# Altium project Pulser_10-2023.PrjPcb
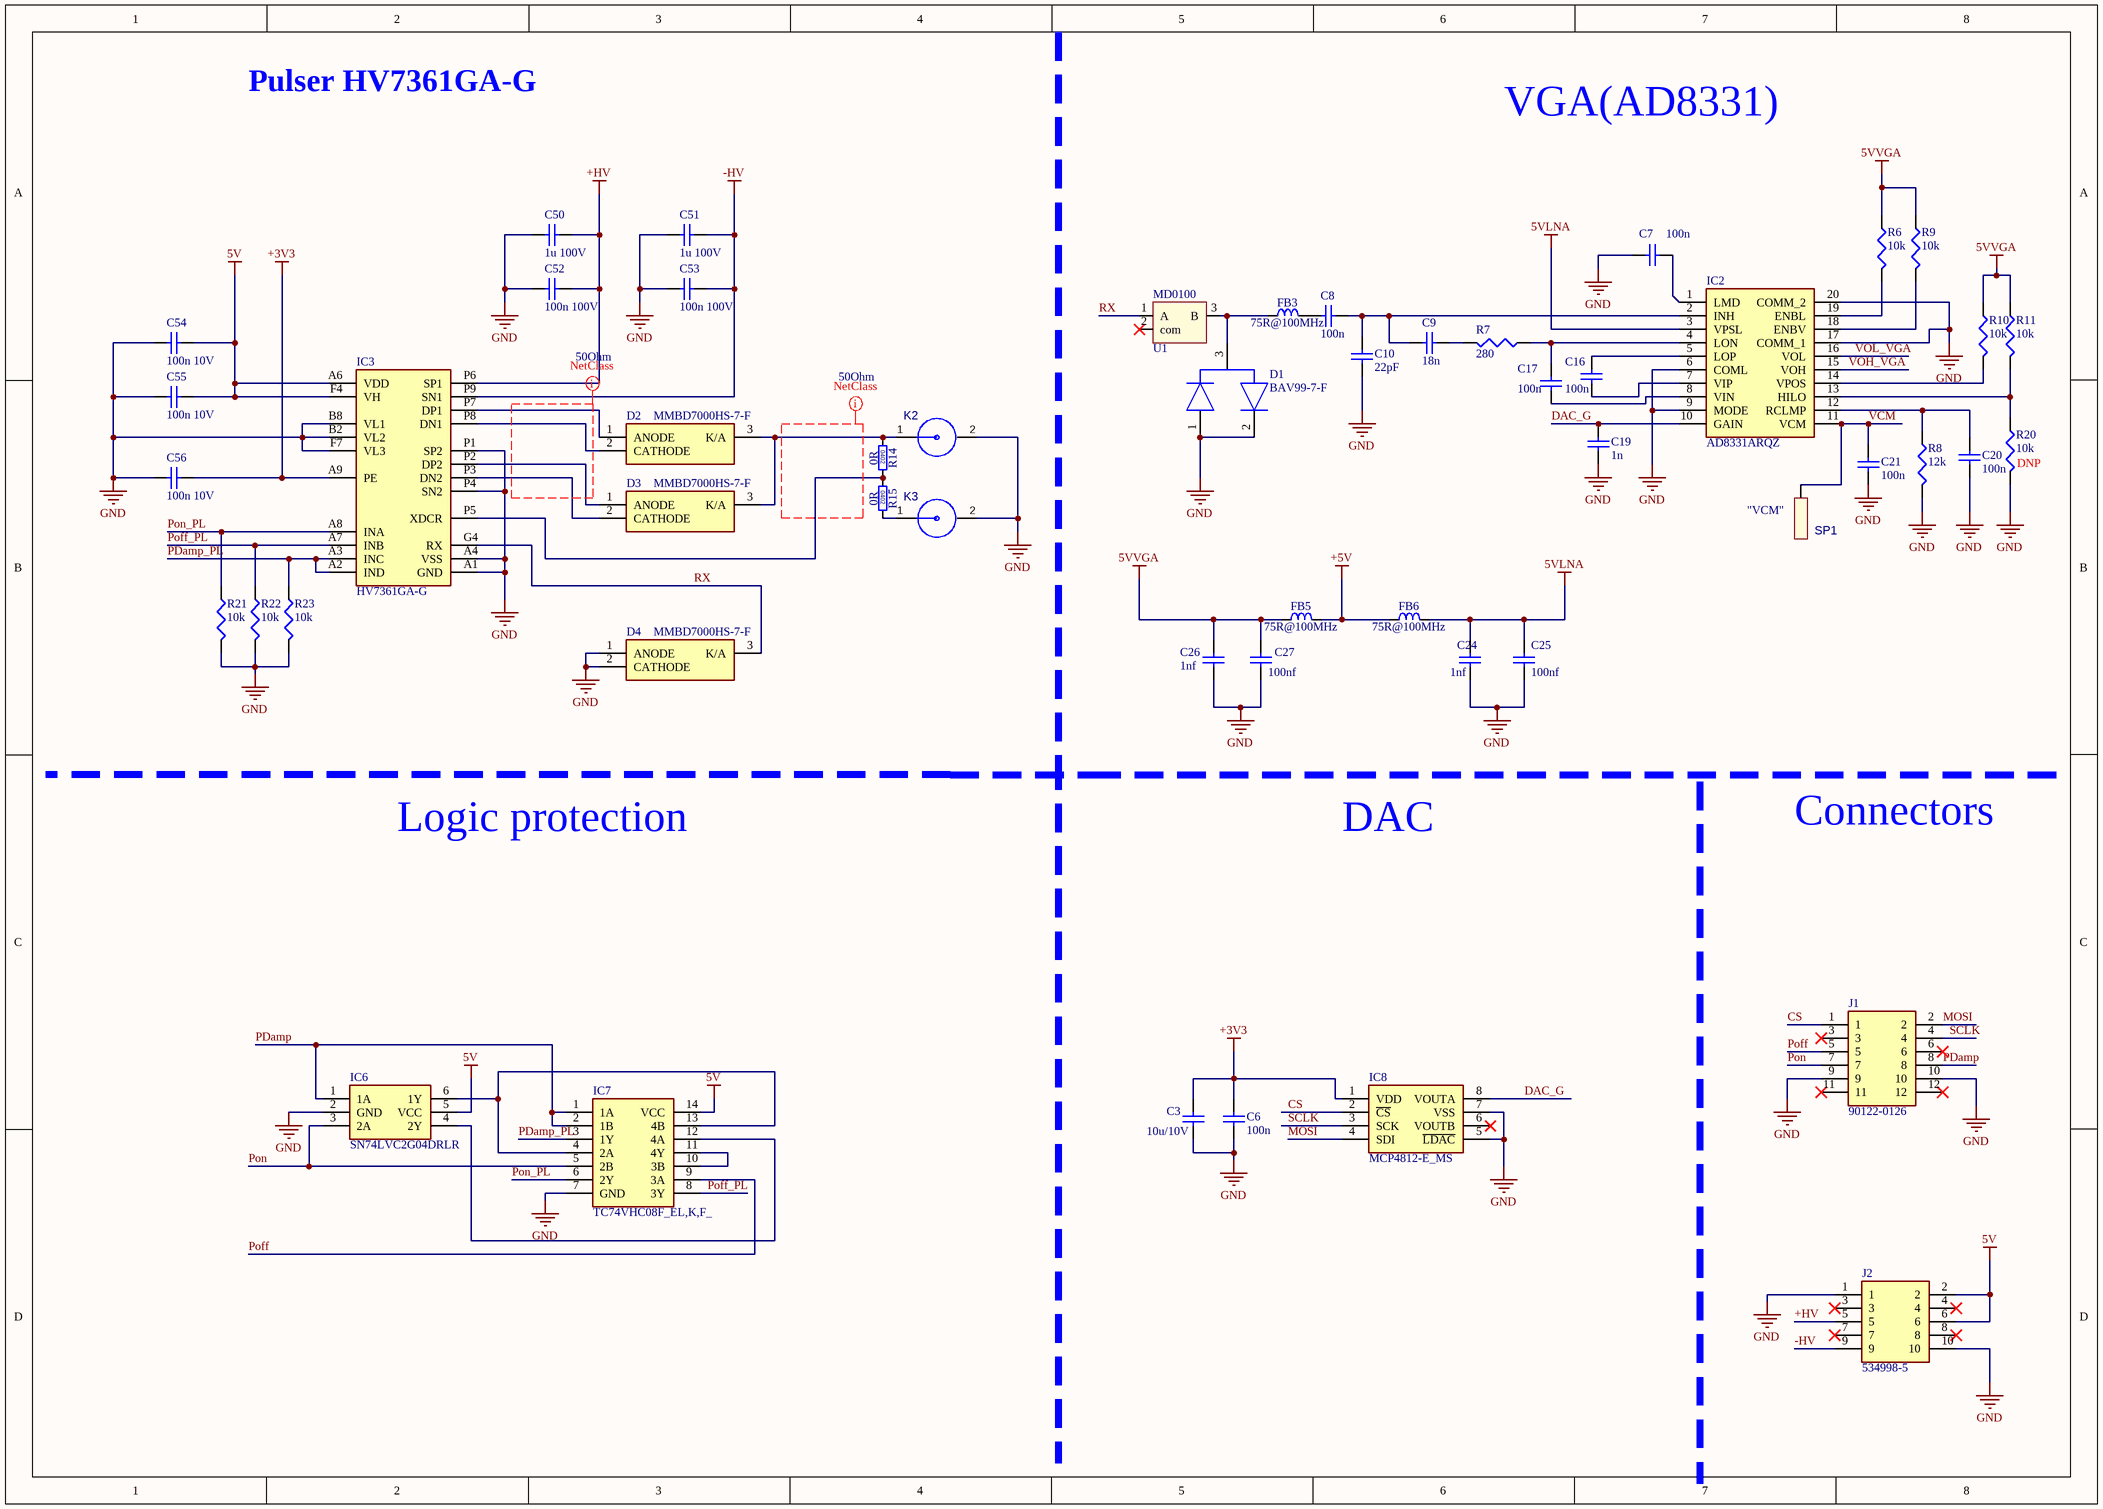
[diagram p0: Pulser & AD8331.SchDoc]
2 sheets, 123 parts. Net scope: global (net labels, ports and power ports of the same name join across sheets).
Board file: Pulser_10-2023.PcbDoc
Sheets:
  Pulser & AD8331.SchDoc
  MSI001 & MSI2500 .SchDoc

## Sheet Pulser & AD8331.SchDoc
size A3

### Parts
C3  value 10u/10V  [0402_C]  (hidden comment: cap0603)
C6  value 100n  [0402_C]  (hidden comment: cap0402)
C7  value 100n  [0402_C]  (hidden comment: cap0402)
C8  value 100n  [0402_C]  (hidden comment: cap0402)
C9  value 18n  [0402_C]  (hidden comment: cap0402)
C10  value 22pF  [0402_C]  (hidden comment: cap0402)
C16  value 100n  [0402_C]  (hidden comment: cap0402)
C17  value 100n  [0402_C]  (hidden comment: cap0402)
C19  value 1n  [0402_C]  (hidden comment: cap0402)
C20  value 100n  [0402_C]  (hidden comment: cap0402)
C21  value 100n  [0402_C]  (hidden comment: cap0402)
C24  value 1nf  [0402_C]  (hidden comment: cap0402)
C25  value 100nf  [0402_C]  (hidden comment: cap0402)
C26  value 1nf  [0402_C]  (hidden comment: cap0402)
C27  value 100nf  [0402_C]  (hidden comment: cap0402)
C50  value 1u 100V  [C0805]  (hidden comment: cap0603)
C51  value 1u 100V  [C0805]  (hidden comment: cap0603)
C52  value 100n 100V  [0402_C]  (hidden comment: cap0402)
C53  value 100n 100V  [0402_C]  (hidden comment: cap0402)
C54  value 100n 10V  [0402_C]  (hidden comment: cap0402)
C55  value 100n 10V  [0402_C]  (hidden comment: cap0402)
C56  value 100n 10V  [0402_C]  (hidden comment: cap0402)
D1  BAV99-7-F  [SOT95P240X120-3N]
D2  MMBD7000HS-7-F  [SOT96P240X110-3N_]
D3  MMBD7000HS-7-F  [SOT96P240X110-3N_]
D4  MMBD7000HS-7-F  [SOT96P240X110-3N_]
FB3  75R@100MHz  [SM0603_3D_res]
FB5  75R@100MHz  [SM0603_3D_res]
FB6  75R@100MHz  [SM0603_3D_res]
IC2  AD8331ARQZ  [SOP64P600X175-20N]
IC3  HV7361GA-G  [BGA22C50P9X14_500X700X105]
IC6  SN74LVC2G04DRLR  [SOTFL50P160X60-6N]
IC7  TC74VHC08F_EL,K,F_  [SOIC127P780X190-14N_]
IC8  MCP4812-E_MS  [SOP65P490X110-8N]
J1  90122-0126  [HDRRA12W65P254_2X6_1516X250X615P]
J2  534998-5  [RHDR10W77P254X254_2X5_1270X503X635P]
K2  SMA_Edge  [AMPHENOL_132357-11]  (value not drawn)
K3  SMA_Edge  [AMPHENOL_132357-11]  (value not drawn)
R6  10k  [0402_R]
R7  280  [0402_R]
R8  12k  [0402_R]
R9  10k  [0402_R]
R10  10k  [0402_R]
R11  10k  [0402_R]
R14  0R  [0402_R]
R15  0R  [0402_R]
R20  10k  [0402_R]
R21  10k  [0402_R]
R22  10k  [0402_R]
R23  10k  [0402_R]
SP1  value "VCM"  [SolderPad_D1mm _round]  (hidden comment: SolderPad D1mm_round)
U1  T/R switch  [SOT89-150P409X160-3N]  (value not drawn)

### Nets
5V: C54.1 C55.1 IC3.A6(VDD) IC3.F4(VH) IC6.5(VCC) IC7.14(VCC) J2.2 J2.6
5VLNA: C24.2 C25.2 FB6.2 IC2.3(VPSL)
5VVGA: C26.2 C27.2 FB5.1 R6.1 R9.1 R10.1 R11.1
+3V3: C3.1 C6.1 C56.1 IC3.A9(PE) IC8.1(VDD)
+5V: FB5.2 FB6.1
+HV: C50.1 C52.2 IC3.P6(SP1) J2.5
-HV: C51.1 C53.2 IC3.P9(SN1) J2.9
GND: C3.2 C6.2 C7.1 C10.1 C19.1 C20.1 C21.2 C24.1 C25.1 C26.1 C27.1 C50.2 C51.2 C52.1 C53.1 C54.2 C55.2 C56.2 D1.1(ANODE) D1.2(CATHODE) D4.1(ANODE) D4.2(CATHODE) IC2.6(COML) IC2.9(MODE) IC2.17(COMM_1) IC2.20(COMM_2) IC3.A1(GND) IC3.A4(VSS) IC3.B2(VL2) IC3.B8(VL1) IC3.F7(VL3) IC3.P1(SP2) IC3.P4(SN2) IC6.2(GND) IC7.7(GND) IC8.5(~{LDAC}) IC8.7(VSS) J1.9 J1.10 J2.1 J2.10 K2.2 K3.2 R8.2 R20.2 R21.2 R22.2 R23.2
CS: IC8.2(~{CS}) J1.1
DAC_G: C19.2 IC2.10(GAIN) IC8.8(VOUTA)
MOSI: IC8.4(SDI) J1.2
PDamp: IC6.1(1A) IC7.1(1A) IC7.2(1B) J1.8
PDamp_PL: IC3.A2(IND) IC3.A3(INC) IC7.3(1Y) R23.1
Poff: IC7.9(3A) J1.5
Poff_PL: IC3.A7(INB) IC7.8(3Y) R22.1
Pon: IC6.3(2A) IC7.5(2B) J1.7
Pon_PL: IC3.A8(INA) IC7.6(2Y) R21.1
RX: D4.3(K/A) IC3.G4(RX) U1.1(A)
SCLK: IC8.3(SCK) J1.4
VCM: C21.1 IC2.11(VCM) SP1.1
VOH_VGA: IC2.15(VOH)
VOL_VGA: IC2.16(VOL)
NetC7_2: C7.2 IC2.1(LMD)
NetC8_1: C8.1 FB3.2
NetC8_2: C8.2 C9.2 C10.2 IC2.2(INH)
NetC9_1: C9.1 R7.2
NetC16_1: C16.1 IC2.7(VIP)
NetC16_2: C16.2 IC2.5(LOP)
NetC17_1: C17.1 IC2.8(VIN)
NetC17_2: C17.2 IC2.4(LON) R7.1
NetC20_2: C20.2 IC2.12(RCLMP) R8.1
NetD1_3: D1.3(A/K) FB3.1 U1.3(B)
NetD2_1: D2.1(ANODE) IC3.P7(DP1)
NetD2_2: D2.2(CATHODE) IC3.P8(DN1)
NetD2_3: D2.3(K/A) D3.3(K/A) K2.1 R14.1
NetD3_1: D3.1(ANODE) IC3.P2(DP2)
NetD3_2: D3.2(CATHODE) IC3.P3(DN2)
NetIC2_13: IC2.13(HILO) R11.2 R20.1
NetIC2_14: IC2.14(VPOS) R10.2
NetIC2_18: IC2.18(ENBV) R9.2
NetIC2_19: IC2.19(ENBL) R6.2
NetIC3_P5: IC3.P5(XDCR) R14.2 R15.1
NetIC6_4: IC6.4(2Y) IC7.12(4A)
NetIC6_6: IC6.6(1Y) IC7.4(2A) IC7.13(4B)
NetIC7_10: IC7.10(3B) IC7.11(4Y)
NetK3_1: K3.1 R15.2

Not connected (* = marked no-connect by the designer): IC8 6(VOUTB)*; J1 3* 6* 11* 12*; J2 3* 4* 7* 8*; U1 2(com)*

### Layout directives
net class 50Ohm: (no net found under the mark)

### Notes on the sheet
- Pulser HV7361GA-G
- VGA(AD8331)
- (near U1) MD0100
- (near R20) DNP
- Logic protection
- DAC
- Connectors
- (in symbol Res_0402_EU) 0402

### Library data of the parts
C3 C24 C26 C50 C51 = cap0603: Capacitor  0603 inch; Published: 8-Jun-2000; LatestRevisionDate: 17-Jul-2002; LatestRevisionNote: Re-released for DXP Platform.; PackageReference: RAD-0.3; Publisher: Altium Limited; PackageDescription: Radial Cap, Thru-Hole; 2 Leads; 0.3 in Pin Spacing
C6-C10 C16 C17 C19-C21 C25 C27 C52-C56 = cap0603: Capacitor  0402 inch; Published: 8-Jun-2000; LatestRevisionDate: 17-Jul-2002; LatestRevisionNote: Re-released for DXP Platform.; PackageReference: RAD-0.3; Publisher: Altium Limited; PackageDescription: Radial Cap, Thru-Hole; 2 Leads; 0.3 in Pin Spacing
D1 = BAV99-7-F: Diode; Manufacturer_Name: Diodes Inc.; Datasheet Link: https://www.diodes.com/assets/Datasheets/ds12007.pdf; Height: 1.2mm; Manufacturer_Part_Number: BAV99-7-F; Mouser Part Number: 621-BAV99-F; Mouser Price/Stock: https://www.mouser.co.uk/ProductDetail/Diodes-Incorporated/BAV99-7-F?qs=E9Ihi8A05%252BSTVRjo74hQDA%3D%3D; Arrow Part Number: BAV99-7-F; Arrow Price/Stock: https://www.arrow.com/en/products/bav99-7-f/diodes-incorporated?region=nac
D2-D4 = MMBD7000HS-7-F: Diode; Manufacturer_Name: Diodes Inc.; Datasheet Link: https://www.diodes.com/assets/Datasheets/ds31782.pdf; Height: 1.1mm; Manufacturer_Part_Number: MMBD7000HS-7-F; Mouser Part Number: 621-MMBD7000HS-7-F; Mouser Price/Stock: https://www.mouser.co.uk/ProductDetail/Diodes-Incorporated/MMBD7000HS-7-F/?qs=4YT44p7w2bs7ic313M4gfA%3D%3D; Arrow Part Number: MMBD7000HS-7-F; Arrow Price/Stock: https://www.arrow.com/en/products/mmbd7000hs-7-f/diodes-incorporated
FB3 FB5 FB6 = chip inductance 0603: Part Number: IND0805_MURATA_BLM21BB750SN1D; Part Description: SMD EMIFIL Suppression Chip Ferrite Bead; Manufacturer: MURATA; Manufacturer Part Number: BLM21BB750SN1D; Power: 700mA; Resistance: 0.16R; Tolerance: ±25%; Table: Inductors SMD; Component Kind: Standard; Component Type: Standard; Footprint: INDC2012X105N; Pin Count: 2; Value: 75R@100MHz; Status: None; Case: 0805; Mounted: Yes; Socket: No; SMD: Yes; ComponentHeight: 1.05mm; Author: S. Jafar; CreateDate: 12/21/2015; LatestRevisionDate: 12/21/2015
IC2 = AD8331ARQZ: Integrated Circuit; Manufacturer_Name: Analog Devices; Datasheet Link: http://www.analog.com/static/imported-files/data_sheets/AD8331_8332_8334.pdf; Height: 1.75mm; Manufacturer_Part_Number: AD8331ARQZ; Mouser Part Number: 584-AD8331ARQZ; Mouser Price/Stock: https://www.mouser.co.uk/ProductDetail/Analog-Devices/AD8331ARQZ?qs=%2FtpEQrCGXCwx0%2F22gf7ohQ%3D%3D; Arrow Part Number: AD8331ARQZ; Arrow Price/Stock: https://www.arrow.com/en/products/ad8331arqz/analog-devices
IC3 = HV7361GA-G: Integrated Circuit; Manufacturer_Name: Microchip; Datasheet Link: http://ww1.microchip.com/downloads/en/DeviceDoc/20005570C.pdf; Height: 1.05mm; Manufacturer_Part_Number: HV7361GA-G; Mouser Part Number: 579-HV7361GA-G; Mouser Price/Stock: https://www.mouser.co.uk/ProductDetail/Microchip-Technology/HV7361GA-G?qs=NoqMqJKvPFJ98Yl1cb744A%3D%3D; Arrow Part Number: HV7361GA-G; Arrow Price/Stock: https://www.arrow.com/en/products/hv7361ga-g/microchip-technology
IC6 = SN74LVC2G04DRLR: Integrated Circuit; Manufacturer_Name: Texas Instruments; Datasheet Link: http://www.ti.com/lit/gpn/sn74lvc2g04; Height: 0.6mm; Manufacturer_Part_Number: SN74LVC2G04DRLR; Mouser Part Number: 595-SN74LVC2G04DRLR; Mouser Price/Stock: https://www.mouser.co.uk/ProductDetail/Texas-Instruments/SN74LVC2G04DRLR?qs=pajgIaoyDUgGT9cUBVgEUw%3D%3D; Arrow Part Number: SN74LVC2G04DRLR; Arrow Price/Stock: https://www.arrow.com/en/products/sn74lvc2g04drlr/texas-instruments?region=nac
IC7 = TC74VHC08F_EL,K,F_: Hardware; Manufacturer_Name: Toshiba; Manufacturer_Part_Number: TC74VHC08F(EL,K,F); Datasheet Link: https://componentsearchengine.com/Datasheets/1/TC74VHC08F(EL,K,F).pdf; Height: 1.9mm; Mouser Part Number: 757-TC74VHC08FELKF; Mouser Price/Stock: https://www.mouser.co.uk/ProductDetail/Toshiba/TC74VHC08FELKF?qs=f0GatGUIxV0KIqTggGqR%252BQ%3D%3D
IC8 = MCP4812-E_MS: Integrated Circuit; Manufacturer_Name: Microchip; Manufacturer_Part_Number: MCP4812-E/MS; Datasheet Link: http://ww1.microchip.com/downloads/en/DeviceDoc/20002249B.pdf; Height: 1.1mm; Mouser Part Number: 579-MCP4812-E/MS; Mouser Price/Stock: https://www.mouser.co.uk/ProductDetail/Microchip-Technology/MCP4812-E-MS?qs=bxUt0k7cytJEpyWPtzKy6A%3D%3D; Arrow Part Number: MCP4812-E/MS; Arrow Price/Stock: https://www.arrow.com/en/products/mcp4812-ems/microchip-technology
J1 = 90122-0126: Connector; Manufacturer_Name: Molex; Datasheet Link: https://componentsearchengine.com/Datasheets/2/90122-0126.pdf; Height: 6.15mm; Manufacturer_Part_Number: 90122-0126; Mouser Part Number: 538-90122-0126; Mouser Price/Stock: https://www.mouser.co.uk/ProductDetail/Molex/90122-0126?qs=PvP5v7Eimsm0iCqn6boA0w%3D%3D
J2 = 534998-5: Connector; Manufacturer_Name: TE Connectivity; Datasheet Link: http://uk.rs-online.com/web/p/products/8638265; Height: 6.35mm; Manufacturer_Part_Number: 534998-5; Mouser Part Number: 571-5349985; Mouser Price/Stock: https://www.mouser.co.uk/ProductDetail/TE-Connectivity/534998-5?qs=X1mjqRbeMc7kAKePtTQuSw%3D%3D; Arrow Part Number: 534998-5; Arrow Price/Stock: https://www.arrow.com/en/products/534998-5/te-connectivity?region=nac
R6 R9-R11 R20-R23 = RC0402FR-0710KL: RES 10K OHM 1/16W 1% 0402 SMD; Resistance (Ohms): 280; Power (Watts): 0.063W, 1/16W; .Checked PCB: used; Category: Resistors; Package / Case: 0402 (1005 Metric); Value: 10k; .Checked SCH: used; Size / Dimension: 0.039" L x 0.020" W (1.00mm x 0.50mm); Height: 0.016" (0.40mm); ComponentLink1URL: http://www.yageo.com/documents/recent/PYu-RC0402_51_RoHS_L_6.pdf; ComponentLink1Description: http://www.yageo.com/documents/recent/PYu-RC0402_51_RoHS_L_6.pdf
R7 = RC0402FR-0710KL: RES 280 OHM 1/16W 0402 SMD; Power (Watts): 0.063W, 1/16W; .Checked PCB: used; Category: Resistors; Package / Case: 0402 (1005 Metric); Resistance (Ohms): 280; Value: 280; .Checked SCH: used; Size / Dimension: 0.039" L x 0.020" W (1.00mm x 0.50mm); Height: 0.016" (0.40mm); ComponentLink1URL: http://www.yageo.com/documents/recent/PYu-RC0402_51_RoHS_L_6.pdf; ComponentLink1Description: http://www.yageo.com/documents/recent/PYu-RC0402_51_RoHS_L_6.pdf
R8 = RC0402FR-0710KL: RES 12K OHM 1/16W 0402 SMD; Power (Watts): 0.063W, 1/16W; .Checked PCB: used; Category: Resistors; Package / Case: 0402 (1005 Metric); Value: 12k; .Checked SCH: used; Size / Dimension: 0.039" L x 0.020" W (1.00mm x 0.50mm); Height: 0.016" (0.40mm); ComponentLink1URL: http://www.yageo.com/documents/recent/PYu-RC0402_51_RoHS_L_6.pdf; ComponentLink1Description: http://www.yageo.com/documents/recent/PYu-RC0402_51_RoHS_L_6.pdf
R14 R15 = Res_0402_EU: Part Number: R1206_4K7_1%_0.25W_100PPM; Part Description: General Purpose Thick Film Chip Resistor; Manufacturer: GENERIC; Manufacturer1 Part Number: NRC12F4701TRF; Value: 4k7; Power: 0.25W; TC: ±100ppm/°C; Tolerance: ±1%; Table: Resistors SMD; Component Kind: Standard; Component Type: Standard; Footprint: RESC3216X65N; Pin Count: 2; Status: Preferred; Manufacturer Part Number: R1206_4K7_1%_0.25W_100PPM; Case: 1206; Mounted: Yes; Socket: No; SMD: Yes; Manufacturer1 Example: NIC COMPONENT; Manufacturer1 ComponentHeight: 0.65mm; HelpURL: \\cern.ch\dfs\Applications\Altium\Datasheets\R1206_NIC_NRC.pdf; Author: CERN DEM JLC; CreateDate: 12/3/2007; LatestRevisionDate: 3/13/2008
SP1 = SolderPad D1mm_round: for finger touch
U1 = MD0100N8-G
K2 K3 = SMA_Edge: Value: *

## Sheet MSI001 & MSI2500 .SchDoc
size A3; Organization: Altium Limited; Address1: L3, 12a Rodborough Rd; Address2: Frenchs Forest; Address3: NSW; Address4: Australia 2086
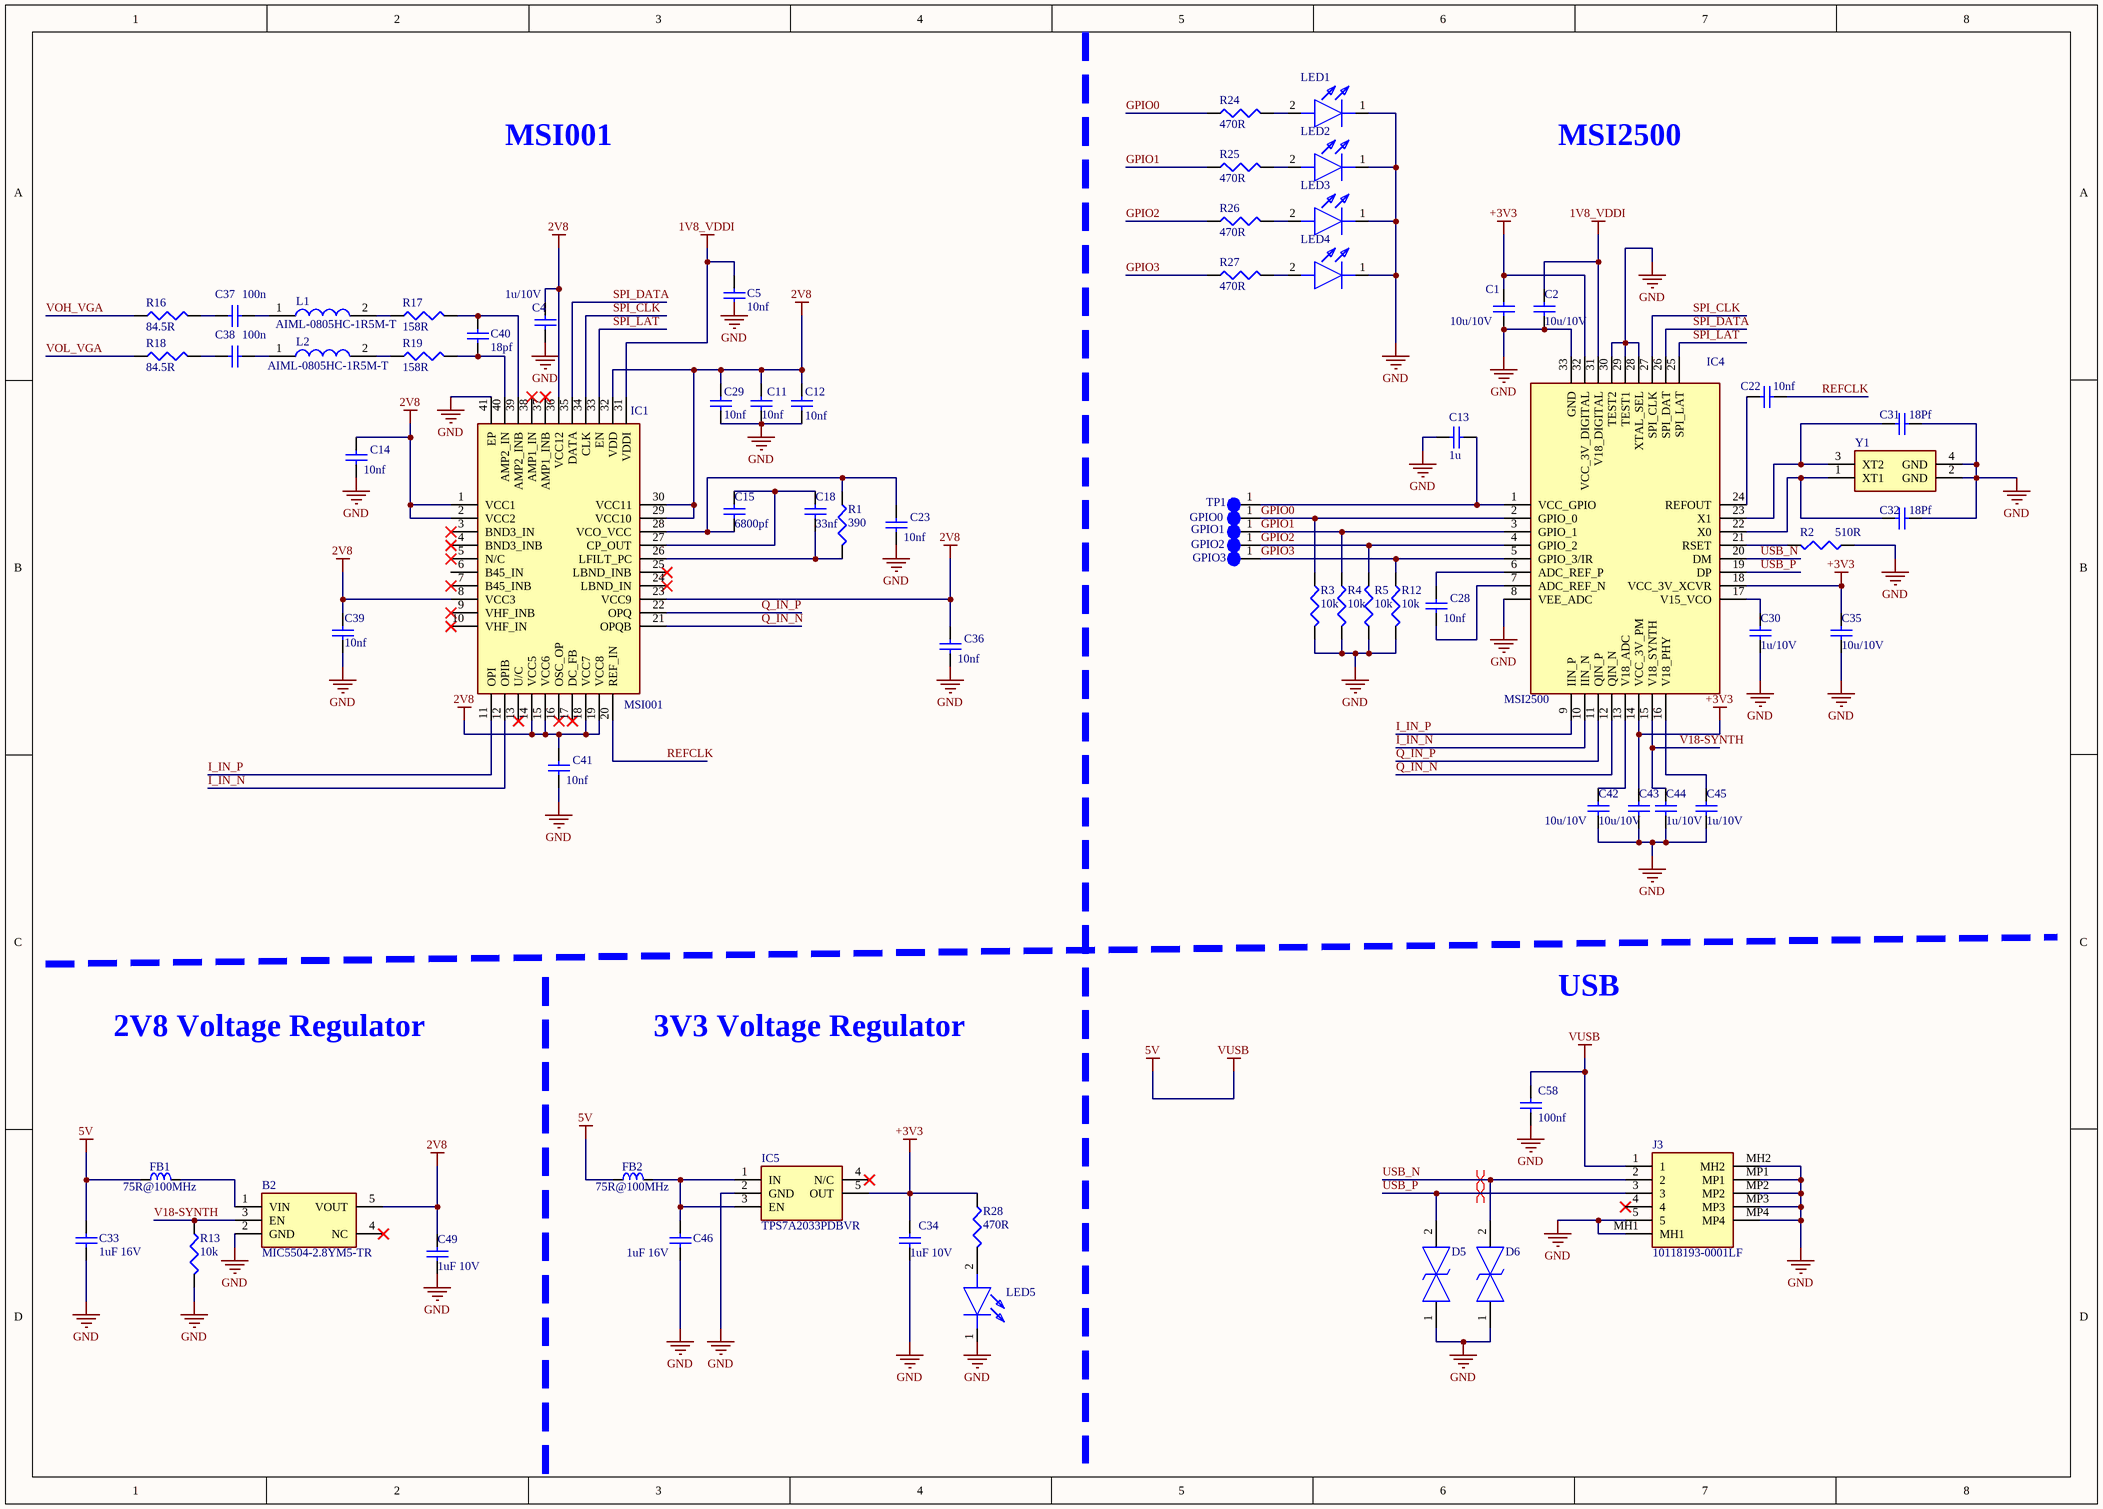
[diagram p1: MSI001 & MSI2500 .SchDoc]

### Parts
B2  MIC5504-2.8YM5-TR  [SOT95P280X145-5N]
C1  value 10u/10V  [0402_C]  (hidden comment: cap0603)
C2  value 10u/10V  [0402_C]  (hidden comment: cap0603)
C4  value 1u/10V  [0402_C]  (hidden comment: cap0603)
C5  value 10nf  [0402_C]  (hidden comment: cap0402)
C11  value 10nf  [0402_C]  (hidden comment: cap0402)
C12  value 10nf  [0402_C]  (hidden comment: cap0402)
C13  value 1u  [0402_C]  (hidden comment: cap0603)
C14  value 10nf  [0402_C]  (hidden comment: cap0402)
C15  value 6800pf  [0402_C]  (hidden comment: cap0402)
C18  value 33nf  [0402_C]  (hidden comment: cap0402)
C22  value 10nf  [0402_C]  (hidden comment: cap0402)
C23  value 10nf  [0402_C]  (hidden comment: cap0402)
C28  value 10nf  [0402_C]  (hidden comment: cap0402)
C29  value 10nf  [0402_C]  (hidden comment: cap0402)
C30  value 1u/10V  [0402_C]  (hidden comment: cap0603)
C31  value 18Pf  [0402_C]  (hidden comment: cap0402)
C32  value 18Pf  [0402_C]  (hidden comment: cap0402)
C33  value 1uF 16V  [SM0603 _3D_cap]  (hidden comment: cap0603)
C34  value 1uF 10V  [0402_C]  (hidden comment: cap0603)
C35  value 10u/10V  [0402_C]  (hidden comment: cap0603)
C36  value 10nf  [0402_C]  (hidden comment: cap0402)
C37  value 100n  [0402_C]  (hidden comment: cap0402)
C38  value 100n  [0402_C]  (hidden comment: cap0402)
C39  value 10nf  [0402_C]  (hidden comment: cap0402)
C40  value 18pf  [0402_C]  (hidden comment: cap0402)
C41  value 10nf  [0402_C]  (hidden comment: cap0402)
C42  value 10u/10V  [0402_C]  (hidden comment: cap0603)
C43  value 10u/10V  [0402_C]  (hidden comment: cap0603)
C44  value 1u/10V  [0402_C]  (hidden comment: cap0603)
C45  value 1u/10V  [0402_C]  (hidden comment: cap0603)
C46  value 1uF 16V  [SM0603 _3D_cap]  (hidden comment: cap0603)
C49  value 1uF 10V  [0402_C]  (hidden comment: cap0603)
C58  value 100nf  [0402_C]  (hidden comment: cap0402)
D5  ESD101B102ELSE6327XTSA1  [ESD207B102ELE6327]  (value not drawn)
D6  ESD101B102ELSE6327XTSA1  [ESD207B102ELE6327]  (value not drawn)
FB1  75R@100MHz  [SM0603_3D_res]
FB2  75R@100MHz  [SM0603_3D_res]
GPIO0  TP  [TP_1mm]  (value not drawn)
GPIO1  TP  [TP_1mm]  (value not drawn)
GPIO2  TP  [TP_1mm]  (value not drawn)
GPIO3  TP  [TP_1mm]  (value not drawn)
IC1  MSI001  [QFN50P600X600X90-41N-D]
IC4  MSI2500  [QFN50P500X500X90-33N-D]
IC5  TPS7A2033PDBVR  [SOT95P280X145-5N]
J3  10118193-0001LF  [101181930001LF]
L1  AIML-0805HC-1R5M-T  [INDC2012X95N]
L2  AIML-0805HC-1R5M-T  [INDC2012X95N]
LED1  LTST-C190GKT  [LEDC1608X90N]  (value not drawn)
LED2  LTST-C190GKT  [LEDC1608X90N]  (value not drawn)
LED3  LTST-C190GKT  [LEDC1608X90N]  (value not drawn)
LED4  LTST-C190GKT  [LEDC1608X90N]  (value not drawn)
LED5  LTST-C190GKT  [LEDC1608X90N]  (value not drawn)
R1  390  [0402_R]
R2  510R  [0402_R]
R3  10k  [0402_R]
R4  10k  [0402_R]
R5  10k  [0402_R]
R12  10k  [0402_R]
R13  10k  [0402_R]
R16  84.5R  [0402_R]
R17  158R  [0402_R]
R18  84.5R  [0402_R]
R19  158R  [0402_R]
R24  470R  [0402_R]
R25  470R  [0402_R]
R26  470R  [0402_R]
R27  470R  [0402_R]
R28  470R  [0402_R]
TP1  TP  [TP_1mm]  (value not drawn)
Y1  ABM8G-24.000MHZ-18-D2Y-T  [ABM8G]  (value not drawn)

### Nets
1V8_VDDI: C2.2 C5.1 IC1.31(VDDI) IC4.31(V18_DIGITAL)
2V8: B2.5(VOUT) C4.1 C11.1 C12.1 C14.2 C29.1 C36.2 C39.2 C41.2 C49.1 IC1.1(VCC1) IC1.2(VCC2) IC1.8(VCC3) IC1.14(VCC5) IC1.15(VCC6) IC1.18(VCC7) IC1.19(VCC8) IC1.23(VCC9) IC1.29(VCC10) IC1.30(VCC11) IC1.32(VDD) IC1.36(VCC12)
5V: C33.2 C58.2 FB1.1 FB2.1 J3.1  [also labelled VUSB]
+3V3: C1.2 C34.1 C35.1 C43.1 IC4.14(VCC_3V_PM) IC4.18(VCC_3V_XCVR) IC4.32(VCC_3V_DIGITAL) IC5.5(OUT) R28.1
GND: B2.2(GND) C1.1 C2.1 C4.2 C11.2 C12.2 C13.1 C14.1 C23.1 C29.2 C30.2 C31.1 C32.1 C33.1 C34.2 C35.2 C36.1 C39.1 C41.1 C42.2 C43.2 C44.2 C45.2 C46.1 C49.2 C58.1 D5.1 D6.1 IC1.41(EP) IC4.8(VEE_ADC) IC4.28(XTAL_SEL) IC4.29(TEST1) IC4.30(TEST2) IC4.33(GND) IC5.2(GND) J3.5 J3.MH1 J3.MH2 J3.MP1 J3.MP2 J3.MP3 J3.MP4 LED1.1(K) LED2.1(K) LED3.1(K) LED4.1(K) LED5.1(K) R2.1 R3.2 R4.2 R5.1 R12.2 R13.2 Y1.2(GND) Y1.4(GND)
GPIO0: GPIO0.1 IC4.2(GPIO_0) R3.1 R24.1
GPIO1: GPIO1.1 IC4.3(GPIO_1) R4.1 R25.1
GPIO2: GPIO2.1 IC4.4(GPIO_2) R5.2 R26.1
GPIO3: GPIO3.1 IC4.5(GPIO_3/IR) R12.1 R27.1
I_IN_N: IC1.12(OPIB) IC4.10(IIN_N)
I_IN_P: IC1.11(OPI) IC4.9(IIN_P)
Q_IN_N: IC1.21(OPQB) IC4.12(QIN_N)
Q_IN_P: IC1.22(OPQ) IC4.11(QIN_P)
REFCLK: C22.1 IC1.20(REF_IN)
SPI_CLK: IC1.34(CLK) IC4.27(SPI_CLK)
SPI_DATA: IC1.35(DATA) IC4.26(SPI_DAT)
SPI_LAT: IC1.33(EN) IC4.25(SPI_LAT)
USB_N: D6.2 IC4.20(DM) J3.2
USB_P: D5.2 IC4.19(DP) J3.3
V18-SYNTH: B2.3(EN) C44.1 IC4.15(V18_SYNTH) R13.1
VOH_VGA: R16.1
VOL_VGA: R18.1
NetB2_1: B2.1(VIN) FB1.2
NetC13_2: C13.2 IC4.1(VCC_GPIO) TP1.1
NetC15_1: C15.1 C18.2 IC1.27(CP_OUT)
NetC15_2: C15.2 C23.2 IC1.28(VCO_VCC) R1.1
NetC18_1: C18.1 IC1.26(LFILT_PC) R1.2
NetC22_2: C22.2 IC4.24(REFOUT)
NetC28_1: C28.1 IC4.7(ADC_REF_N)
NetC28_2: C28.2 IC4.6(ADC_REF_P)
NetC30_1: C30.1 IC4.17(V15_VCO)
NetC31_2: C31.2 IC4.23(X1) Y1.3(XT2)
NetC32_2: C32.2 IC4.22(X0) Y1.1(XT1)
NetC37_1: C37.1 L1.1
NetC37_2: C37.2 R16.2
NetC38_1: C38.1 L2.1
NetC38_2: C38.2 R18.2
NetC40_1: C40.1 IC1.39(AMP2_INB) R17.2
NetC40_2: C40.2 IC1.40(AMP2_IN) R19.2
NetC42_1: C42.1 IC4.13(V18_ADC)
NetC45_1: C45.1 IC4.16(V18_PHY)
NetC46_2: C46.2 FB2.2 IC5.1(IN) IC5.3(EN)
NetIC4_21: IC4.21(RSET) R2.2
NetL1_2: L1.2 R17.1
NetL2_2: L2.2 R19.1
NetLED1_2: LED1.2(A) R24.2
NetLED2_2: LED2.2(A) R25.2
NetLED3_2: LED3.2(A) R26.2
NetLED4_2: LED4.2(A) R27.2
NetLED5_2: LED5.2(A) R28.2

Not connected (* = marked no-connect by the designer): B2 4(NC)*; C5 2; IC1 3(BND3_IN)* 4(BND3_INB)* 5(N/C)* 6(B45_IN) 7(B45_INB)* 9(VHF_INB)* 10(VHF_IN)* 13(U/C)* 16(OSC_OP)* 17(DC_FB)* 24(LBND_IN)* 25(LBND_INB)* 37(AMP1_INB)* 38(AMP1_IN)*; IC5 4(N/C)*; J3 4*

### Layout directives
differential pair: USB_N, USB_P

### Notes on the sheet
- MSI001
- MSI2500
- 2V8 Voltage Regulator
- 3V3 Voltage Regulator
- USB
- Labels drawn without touching a wire or pin: GND

### Library data of the parts
B2 = MIC5504-2.8YM5-TR: MICROCHIP - MIC5504-2.8YM5-TR - LDO VOLT REG, 0.3A, 2.8V, SOT-23-5; Geometry.Height: 1.45mm; Manufacturer_Name: Microchip; Manufacturer_Part_Number: MIC5504-2.8YM5-TR; Mouser Part Number: 998-MIC5504-2.8YM5TR; Mouser Price/Stock: https://www.mouser.co.uk/ProductDetail/Microchip-Technology/MIC5504-2.8YM5-TR?qs=U6T8BxXiZAXJ2TbsJS3NiQ%3D%3D; Arrow Part Number: MIC5504-2.8YM5-TR; Arrow Price/Stock: https://www.arrow.com/en/products/mic5504-2.8ym5-tr/microchip-technology?region=nac; Datasheet Link: https://datasheet.datasheetarchive.com/originals/distributors/DKDS-15/280852.pdf
C1 C2 C4 C13 C30 C33-C35 C42-C46 C49 = cap0603: Capacitor  0603 inch; Published: 8-Jun-2000; LatestRevisionDate: 17-Jul-2002; LatestRevisionNote: Re-released for DXP Platform.; PackageReference: RAD-0.3; Publisher: Altium Limited; PackageDescription: Radial Cap, Thru-Hole; 2 Leads; 0.3 in Pin Spacing
C5 C11 C12 C14 C15 C18 C22 C23 C28 C29 C31 C32 C36-C41 C58 = cap0603: Capacitor  0402 inch; Published: 8-Jun-2000; LatestRevisionDate: 17-Jul-2002; LatestRevisionNote: Re-released for DXP Platform.; PackageReference: RAD-0.3; Publisher: Altium Limited; PackageDescription: Radial Cap, Thru-Hole; 2 Leads; 0.3 in Pin Spacing
D5 D6 = ESD101B102ELSE6327XTSA1: TVS Diode (Bi-directional); Manufacturer_Name: Infineon; Datasheet Link: https://www.infineon.com/dgdl/Infineon-ESD101_B1-DS-v01_04-EN.pdf?fileId=db3a30433e9d5d11013e9d6619a20002; Height: 0mm; Manufacturer_Part_Number: ESD101B102ELSE6327XTSA1; Mouser Part Number: 726-ESD101B102ELSE63; Mouser Price/Stock: https://www.mouser.co.uk/ProductDetail/Infineon-Technologies/ESD101B102ELSE6327XTSA1?qs=wqPJ3MBjhrhYgaXAaMnHlw%3D%3D; Arrow Part Number: ESD101B102ELSE6327XTSA1; Arrow Price/Stock: https://www.arrow.com/en/products/esd101b102else6327xtsa1/infineon-technologies-ag?region=nac
FB1 FB2 = chip inductance 0603: as FB3 on sheet Pulser & AD8331; Component Kind: Standard; Component Type: Standard; Footprint: INDC2012X105N; Pin Count: 2; Value: 75R@100MHz; Status: None; Case: 0805; Mounted: Yes; Socket: No; SMD: Yes; ComponentHeight: 1.05mm; Author: S. Jafar; CreateDate: 12/21/2015; LatestRevisionDate: 12/21/2015
GPIO0-GPIO3 TP1 = Test Point: Connector; Manufacturer_Name: Oxley; Manufacturer_Part_Number: 050/LT/B2; Datasheet Link: http://www.farnell.com/datasheets/2644146.pdf?_ga=2.63921641.795442872.1562935128-2061028581.1560430415; Height: 4.5mm
IC1 = MSI001: Integrated Circuit; Manufacturer_Name: MIRICS; Datasheet Link: http://sdr.lt/~hexx/MSi001_Datasheet_R3P3.pdf; Height: 0.9mm; Manufacturer_Part_Number: MSI001
IC4 = MSI2500: Connector; Manufacturer_Name: MIRICS; Datasheet Link: http://sdr.lt/~hexx/MSi2500.pdf; Height: 0.9mm; Manufacturer_Part_Number: MSI2500
IC5 = TPS7A2050PDBVR: Integrated Circuit; Manufacturer_Name: Texas Instruments; Datasheet Link: https://www.ti.com/lit/gpn/tps7a20?HQS=ti-null-null-sf-df-pf-sep-wwe&DCM=yes; Height: 1.45mm; Manufacturer_Part_Number: TPS7A2050PDBVR; Mouser Part Number: 595-TPS7A2050PDBVR; Mouser Price/Stock: https://www.mouser.co.uk/ProductDetail/Texas-Instruments/TPS7A2050PDBVR?qs=hd1VzrDQEGgpoyZ%2F5FZYnQ%3D%3D; Arrow Part Number: TPS7A2050PDBVR; Arrow Price/Stock: https://www.arrow.com/en/products/tps7a2050pdbvr/texas-instruments?region=nac
J3 = 10118193-0001LF: Connector; Manufacturer_Name: Amphenol Communications Solutions; Datasheet Link: https://cdn.amphenol-icc.com/media/wysiwyg/files/drawing/10118193.pdf; Height: 3.3mm; Manufacturer_Part_Number: 10118193-0001LF; Mouser Part Number: 649-10118193-0001LF; Mouser Price/Stock: https://www.mouser.co.uk/ProductDetail/Amphenol-FCI/10118193-0001LF?qs=Ywefl8B65e63Nsqd%252B8HZaQ%3D%3D; Arrow Part Number: 10118193-0001LF; Arrow Price/Stock: https://www.arrow.com/en/products/10118193-0001lf/amphenol-fci?region=nac
L1 L2 = AIML-0805HC-1R5M-T: Inductor; Manufacturer_Name: ABRACON; Datasheet Link: https://abracon.com/Magnetics/inductors/AIML-0805HC.pdf; Height: 0.95mm; Manufacturer_Part_Number: AIML-0805HC-1R5M-T; Mouser Part Number: 815-AIML-0805HC1R5MT; Mouser Price/Stock: https://www.mouser.co.uk/ProductDetail/ABRACON/AIML-0805HC-1R5M-T?qs=7Oetya%252B4D2Cpl0ykYwHcgg%3D%3D; Arrow Part Number: AIML-0805HC-1R5M-T; Arrow Price/Stock: https://www.arrow.com/en/products/aiml-0805hc-1r5m-t/abracon?region=nac
LED1-LED5 = LTST-C190GKT: LED; Manufacturer_Name: Lite-On; Datasheet Link: https://media.digikey.com/pdf/Data%20Sheets/Lite-On%20PDFs/LTST-C190GKT.pdf; Height: 0.9mm; Manufacturer_Part_Number: LTST-C190GKT; Mouser Part Number: 859-LTST-C190GKT; Mouser Price/Stock: https://www.mouser.co.uk/ProductDetail/Lite-On/LTST-C190GKT?qs=drxkyCeiWgbQzclgbojDOg%3D%3D; Arrow Part Number: LTST-C190GKT; Arrow Price/Stock: https://www.arrow.com/en/products/ltst-c190gkt/lite-on-technology?region=nac
R1 R2 = RC0402FR-0710KL: RES 280 OHM 1/16W 0402 SMD; Resistance (Ohms): 280; Power (Watts): 0.063W, 1/16W; Value: 280; .Checked PCB: used; Category: Resistors; Package / Case: 0402 (1005 Metric); .Checked SCH: used; Size / Dimension: 0.039" L x 0.020" W (1.00mm x 0.50mm); Height: 0.016" (0.40mm); ComponentLink1URL: http://www.yageo.com/documents/recent/PYu-RC0402_51_RoHS_L_6.pdf; ComponentLink1Description: http://www.yageo.com/documents/recent/PYu-RC0402_51_RoHS_L_6.pdf
R3-R5 R12 R13 R24-R28 = RC0402FR-0710KL: as R6 on sheet Pulser & AD8331; Category: Resistors; Package / Case: 0402 (1005 Metric); Value: 10k; .Checked SCH: used; Size / Dimension: 0.039" L x 0.020" W (1.00mm x 0.50mm); Height: 0.016" (0.40mm); ComponentLink1URL: http://www.yageo.com/documents/recent/PYu-RC0402_51_RoHS_L_6.pdf; ComponentLink1Description: http://www.yageo.com/documents/recent/PYu-RC0402_51_RoHS_L_6.pdf
R16 R18 = RC0402FR-0710KL: RES 10K OHM 1/16W 0402 SMD; Power (Watts): 0.063W, 1/16W; .Checked PCB: used; Category: Resistors; Package / Case: 0402 (1005 Metric); Value: 10k; .Checked SCH: used; Size / Dimension: 0.039" L x 0.020" W (1.00mm x 0.50mm); Height: 0.016" (0.40mm); ComponentLink1URL: http://www.yageo.com/documents/recent/PYu-RC0402_51_RoHS_L_6.pdf; ComponentLink1Description: http://www.yageo.com/documents/recent/PYu-RC0402_51_RoHS_L_6.pdf
R17 R19 = RC0402FR-0710KL: RES 18 OHM 1/16W 0402 SMD; Power (Watts): 0.063W, 1/16W; Value: 18R; .Checked PCB: used; Category: Resistors; Package / Case: 0402 (1005 Metric); .Checked SCH: used; Size / Dimension: 0.039" L x 0.020" W (1.00mm x 0.50mm); Height: 0.016" (0.40mm); ComponentLink1URL: http://www.yageo.com/documents/recent/PYu-RC0402_51_RoHS_L_6.pdf; ComponentLink1Description: http://www.yageo.com/documents/recent/PYu-RC0402_51_RoHS_L_6.pdf
Y1 = ABM8G-24.000MHZ-18-D2Y-T: Crystal or Oscillator; Manufacturer_Name: ABRACON; Datasheet Link: https://abracon.com/Resonators/ABM8G.pdf; Height: 1mm; Manufacturer_Part_Number: ABM8G-24.000MHZ-18-D2Y-T; Mouser Part Number: 815-ABM8G-24-18-D2Y; Mouser Price/Stock: https://www.mouser.co.uk/ProductDetail/ABRACON/ABM8G-24.000MHZ-18-D2Y-T?qs=3LVMET7lfiPTenlO89lQpg%3D%3D; Arrow Part Number: ABM8G-24.000MHZ-18-D2Y-T; Arrow Price/Stock: https://www.arrow.com/en/products/abm8g-24.000mhz-18-d2y-t/abracon?region=nac

## Nets that join several sheets
5V: Pulser & AD8331 (8 pins), MSI001 & MSI2500  (5 pins)
+3V3: Pulser & AD8331 (5 pins), MSI001 & MSI2500  (9 pins)
GND: Pulser & AD8331 (48 pins), MSI001 & MSI2500  (55 pins)
VOH_VGA: Pulser & AD8331 (IC2.15), MSI001 & MSI2500  (R16.1)
VOL_VGA: Pulser & AD8331 (IC2.16), MSI001 & MSI2500  (R18.1)